# EAGLE design 503-WS2811-Multi_RV100 (EAGLE 9.6.2)
AUTHORS: Design: Dominik - Idee: Hardi & Michael; DATUM: 2021-08-15; VERSION: Ver.: 0.6

## Sheet 1 of 2
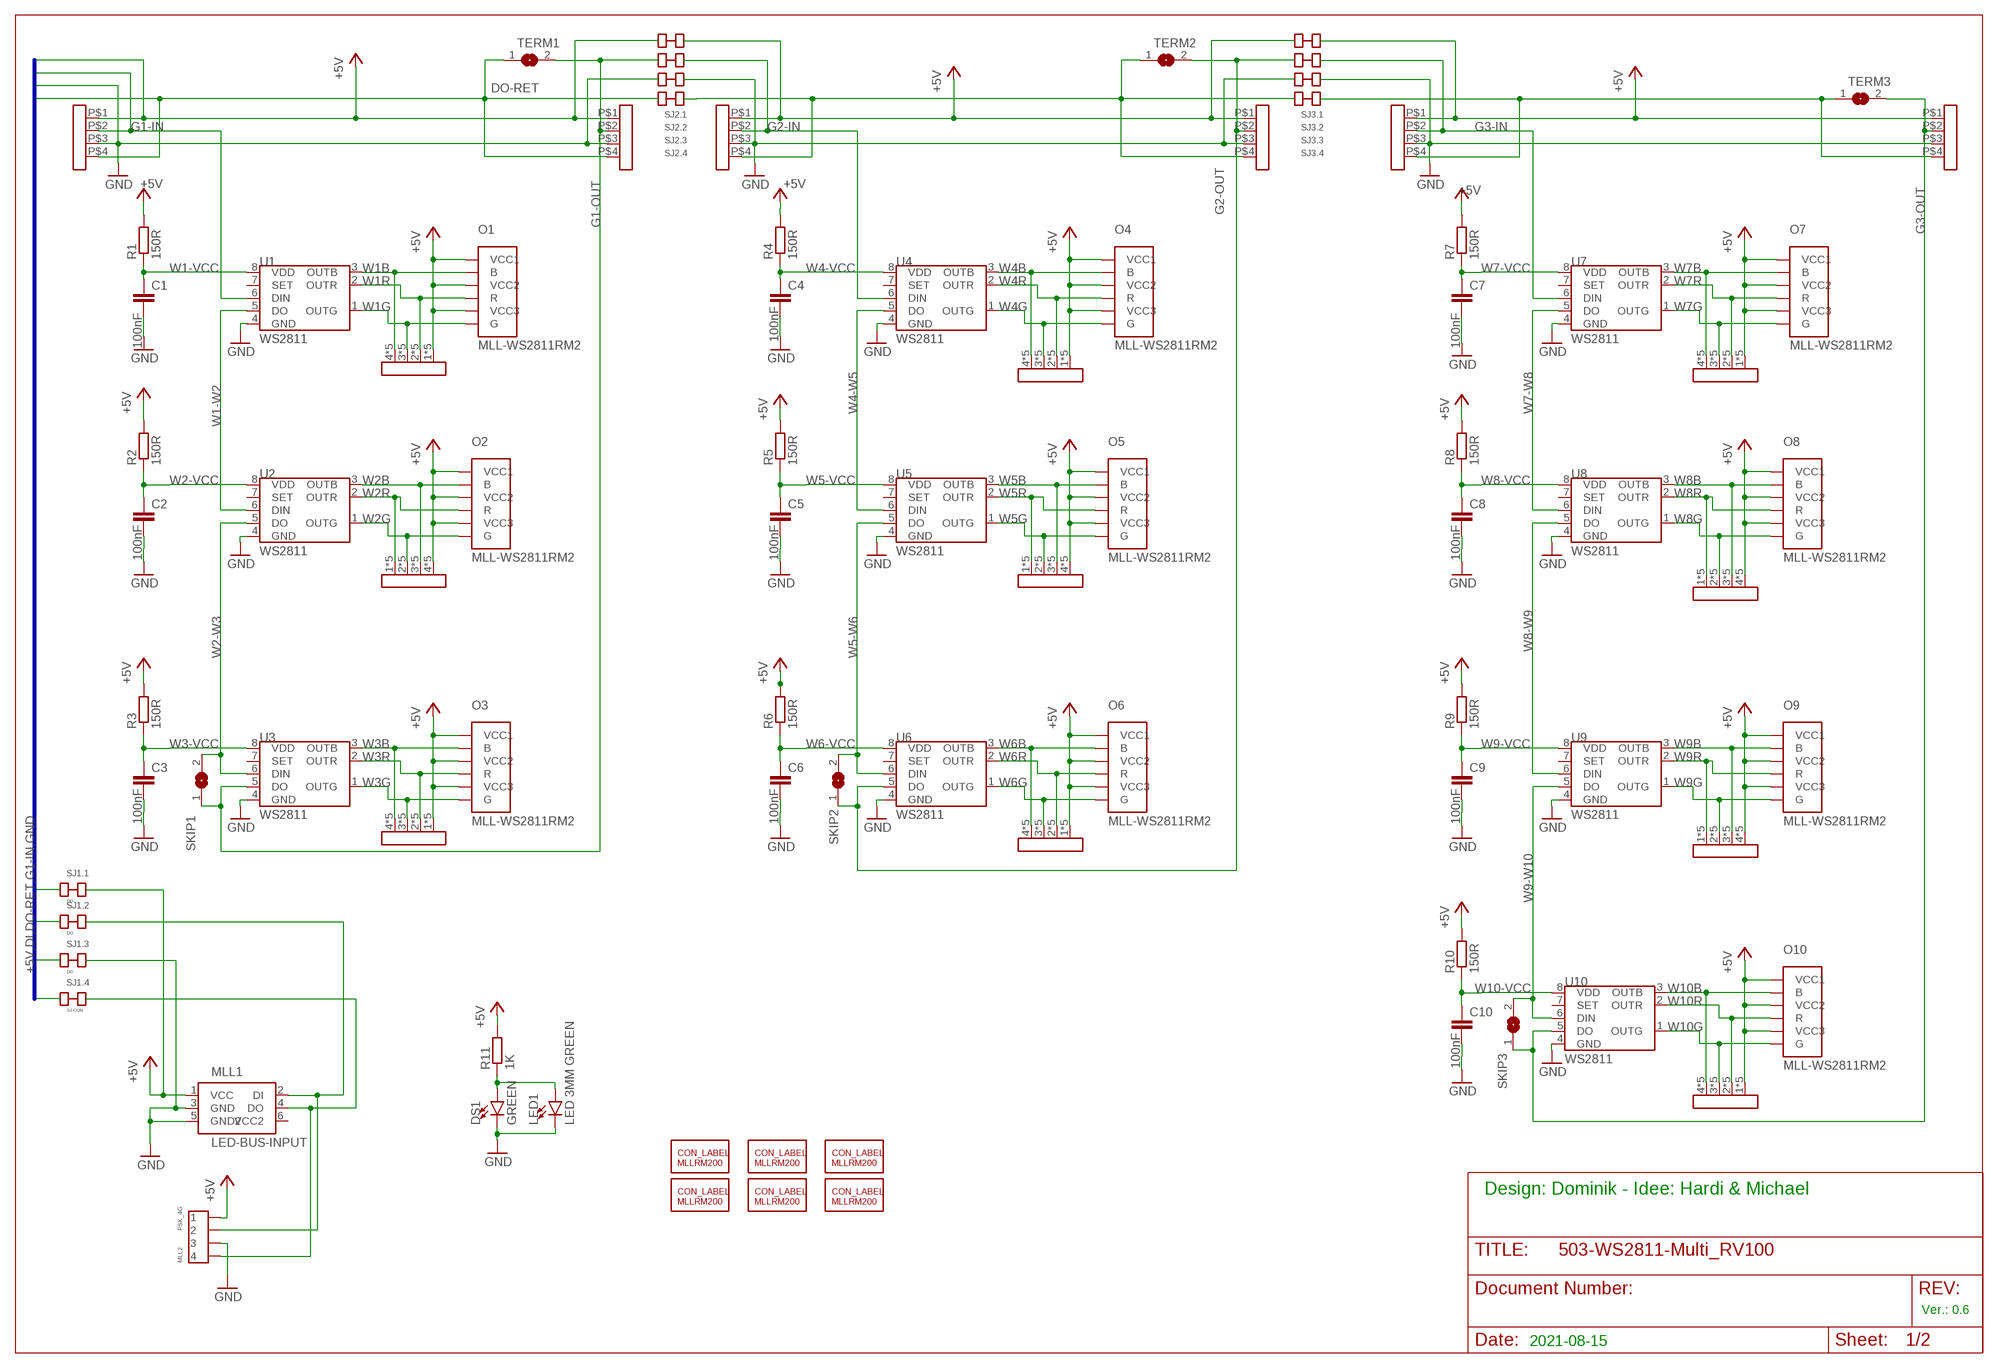
[diagram p0: schematic, sheet 1]

### Parts
C1  100nF  C-EUC1206  [C1206]
C2  100nF  C-EUC1206  [C1206]
C3  100nF  C-EUC1206  [C1206]
C4  100nF  C-EUC1206  [C1206]
C5  100nF  C-EUC1206  [C1206]
C6  100nF  C-EUC1206  [C1206]
C7  100nF  C-EUC1206  [C1206]
C8  100nF  C-EUC1206  [C1206]
C9  100nF  C-EUC1206  [C1206]
C10  100nF  C-EUC1206  [C1206]
DS1  GREEN  LED-GREEN1206  [LED-1206]
IN  4XRM254  [4XRM254]
LED1  LED 3MM GREEN  LED3MM  [LED_3MM]
M1_IN  4XRM254  [4XRM254]
M1_OUT  4XRM254  [4XRM254]
M2_IN  4XRM254  [4XRM254]
M2_OUT  4XRM254  [4XRM254]
MLL1  LED-BUS-INPUT  [IDC6]
MLL2  PSK_4G  [PSSG4]
O1  MLL-WS2811RM2  [MLL-WS2811-RM2]
O2  MLL-WS2811RM2  [MLL-WS2811-RM2]
O3  MLL-WS2811RM2  [MLL-WS2811-RM2]
O4  MLL-WS2811RM2  [MLL-WS2811-RM2]
O5  MLL-WS2811RM2  [MLL-WS2811-RM2]
O6  MLL-WS2811RM2  [MLL-WS2811-RM2]
O7  MLL-WS2811RM2  [MLL-WS2811-RM2]
O8  MLL-WS2811RM2  [MLL-WS2811-RM2]
O9  MLL-WS2811RM2  [MLL-WS2811-RM2]
O10  MLL-WS2811RM2  [MLL-WS2811-RM2]
OUT  4XRM254  [4XRM254]
R1  150R  R-EU_R1206  [R1206]
R2  150R  R-EU_R1206  [R1206]
R3  150R  R-EU_R1206  [R1206]
R4  150R  R-EU_R1206  [R1206]
R5  150R  R-EU_R1206  [R1206]
R6  150R  R-EU_R1206  [R1206]
R7  150R  R-EU_R1206  [R1206]
R8  150R  R-EU_R1206  [R1206]
R9  150R  R-EU_R1206  [R1206]
R10  150R  R-EU_R1206  [R1206]
R11  1K  R-EU_R1206  [R1206]
SJ1.1  DO  SJ-CON  [SJ-CON]
SJ1.2  DO  SJ-CON  [SJ-CON]
SJ1.3  DO  SJ-CON  [SJ-CON]
SJ1.4  SJ-CON  [SJ-CON]
SJ2.1  SJ-CON  [SJ-CON]
SJ2.2  SJ-CON  [SJ-CON]
SJ2.3  SJ-CON  [SJ-CON]
SJ2.4  SJ-CON  [SJ-CON]
SJ3.1  SJ-CON  [SJ-CON]
SJ3.2  SJ-CON  [SJ-CON]
SJ3.3  SJ-CON  [SJ-CON]
SJ3.4  SJ-CON  [SJ-CON]
SKIP1  SJ  [SJ]
SKIP2  SJ  [SJ]
SKIP3  SJ  [SJ]
TERM1  SJ  [SJ]
TERM2  SJ  [SJ]
TERM3  SJ  [SJ]
U1  WS2811  WS2811-ICSOP8  [SOP8]
U2  WS2811  WS2811-ICSOP8  [SOP8]
U3  WS2811  WS2811-ICSOP8  [SOP8]
U4  WS2811  WS2811-ICSOP8  [SOP8]
U5  WS2811  WS2811-ICSOP8  [SOP8]
U6  WS2811  WS2811-ICSOP8  [SOP8]
U7  WS2811  WS2811-ICSOP8  [SOP8]
U8  WS2811  WS2811-ICSOP8  [SOP8]
U9  WS2811  WS2811-ICSOP8  [SOP8]
U10  WS2811  WS2811-ICSOP8  [SOP8]
U$1  CON-LABEL_MLLRM200_2RGB_M  [CON-LABEL_MLLRM200_RGB_M]
U$2  CON-LABEL_MLLRM200_3  [CON-LABEL_MLLRM200_3]
U$3  CON-LABEL_MLLRM200_2RGB_M  [CON-LABEL_MLLRM200_RGB_M]
U$4  CON-LABEL_MLLRM200_2RGB_M  [CON-LABEL_MLLRM200_RGB_M]
U$5  CON-LABEL_MLLRM200_2RGB  [CON-LABEL_MLLRM200_RGB]
U$6  CON-LABEL_MLLRM200_3  [CON-LABEL_MLLRM200_3]
U$7  4XRM200LONG-NOH_DOUBLE  [4XRM200LONG_NOH_DOUBLE]
U$8  4XRM200LONG-NOH_DOUBLE  [4XRM200LONG_NOH_DOUBLE]
U$9  4XRM200LONG-NOH_DOUBLE  [4XRM200LONG_NOH_DOUBLE]
U$14  4XRM200LONG-NOH_DOUBLE  [4XRM200LONG_NOH_DOUBLE]
U$15  4XRM200LONG-NOH_DOUBLE  [4XRM200LONG_NOH_DOUBLE]
U$16  4XRM200LONG-NOH_DOUBLE  [4XRM200LONG_NOH_DOUBLE]
U$17  4XRM200LONG-NOH_DOUBLE  [4XRM200LONG_NOH_DOUBLE]
U$18  4XRM200LONG-NOH_DOUBLE  [4XRM200LONG_NOH_DOUBLE]
U$19  4XRM200LONG-NOH_DOUBLE  [4XRM200LONG_NOH_DOUBLE]
U$20  4XRM200LONG-NOH_DOUBLE  [4XRM200LONG_NOH_DOUBLE]

### Nets
+5V: IN.P$1 M1_IN.P$1 M1_OUT.P$1 M2_IN.P$1 M2_OUT.P$1 MLL1.1(VCC) MLL2.P$1 O1.VCC1 O1.VCC2 O1.VCC3 O2.VCC1 O2.VCC2 O2.VCC3 O3.VCC1 O3.VCC2 O3.VCC3 O4.VCC1 O4.VCC2 O4.VCC3 O5.VCC1 O5.VCC2 O5.VCC3 O6.VCC1 O6.VCC2 O6.VCC3 O7.VCC1 O7.VCC2 O7.VCC3 O8.VCC1 O8.VCC2 O8.VCC3 O9.VCC1 O9.VCC2 O9.VCC3 O10.VCC1 O10.VCC2 O10.VCC3 OUT.P$1 R1.2 R2.2 R3.2 R4.2 R5.2 R6.2 R7.2 R8.2 R9.2 R10.2 R11.2 SJ1.1.P$1 SJ1.1.P$2 SJ2.1.P$1 SJ2.1.P$2 SJ3.1.P$1 SJ3.1.P$2 U$7.1 U$7.1B U$7.11 U$7.12 U$7.13 U$8.4 U$8.4B U$8.41 U$8.42 U$8.43 U$9.1 U$9.1B U$9.11 U$9.12 U$9.13 U$14.1 U$14.1B U$14.11 U$14.12 U$14.13 U$15.4 U$15.4B U$15.41 U$15.42 U$15.43 U$16.1 U$16.1B U$16.11 U$16.12 U$16.13 U$17.1 U$17.1B U$17.11 U$17.12 U$17.13 U$18.4 U$18.4B U$18.41 U$18.42 U$18.43 U$19.4 U$19.4B U$19.41 U$19.42 U$19.43 U$20.1 U$20.1B U$20.11 U$20.12 U$20.13
DI: MLL1.2(DI) MLL2.P$2 SJ1.2.P$2
DO: MLL1.4(DO) MLL2.P$4 SJ1.4.P$2
DO-RET: M1_IN.P$4 M1_OUT.P$4 SJ1.4.P$1 SJ2.4.P$1 TERM1.1
G1-IN: M1_IN.P$2 SJ1.2.P$1 U1.6(DIN)
G1-OUT: M1_OUT.P$2 SJ2.2.P$1 SKIP1.1 TERM1.2 U3.5(DO)
G2-IN: M2_IN.P$2 SJ2.2.P$2 U4.6(DIN)
G2-OUT: M2_OUT.P$2 SJ3.2.P$1 SKIP2.1 TERM2.2 U6.5(DO)
G2-RET: M2_IN.P$4 M2_OUT.P$4 SJ2.4.P$2 SJ3.4.P$1 TERM2.1
G3-IN: IN.P$2 SJ3.2.P$2 U7.6(DIN)
G3-OUT: OUT.P$2 SKIP3.1 TERM3.2 U10.5(DO)
G3-RET: IN.P$4 OUT.P$4 SJ3.4.P$2 TERM3.1
GND: C1.2 C2.2 C3.2 C4.2 C5.2 C6.2 C7.2 C8.2 C9.2 C10.2 DS1.C IN.P$3 LED1.K(C) M1_IN.P$3 M1_OUT.P$3 M2_IN.P$3 M2_OUT.P$3 MLL1.3(GND) MLL1.5(GND2) MLL2.P$3 OUT.P$3 SJ1.3.P$1 SJ1.3.P$2 SJ2.3.P$1 SJ2.3.P$2 SJ3.3.P$1 SJ3.3.P$2 U1.4(GND) U2.4(GND) U3.4(GND) U4.4(GND) U5.4(GND) U6.4(GND) U7.4(GND) U8.4(GND) U9.4(GND) U10.4(GND)
LED1: DS1.A LED1.A R11.1
W1-VCC: C1.1 R1.1 U1.8(VDD)
W1-W2: U1.5(DO) U2.6(DIN)
W1B: O1.B U1.3(OUTB) U$9.4 U$9.4B U$9.41 U$9.42 U$9.43
W1G: O1.G U1.1(OUTG) U$9.3 U$9.3B U$9.31 U$9.32 U$9.33
W1R: O1.R U1.2(OUTR) U$9.2 U$9.2B U$9.21 U$9.22 U$9.23
W2-VCC: C2.1 R2.1 U2.8(VDD)
W2-W3: SKIP1.2 U2.5(DO) U3.6(DIN)
W2B: O2.B U2.3(OUTB) U$8.3 U$8.3B U$8.31 U$8.32 U$8.33
W2G: O2.G U2.1(OUTG) U$8.2 U$8.2B U$8.21 U$8.22 U$8.23
W2R: O2.R U2.2(OUTR) U$8.1 U$8.1B U$8.11 U$8.12 U$8.13
W3-VCC: C3.1 R3.1 U3.8(VDD)
W3B: O3.B U3.3(OUTB) U$7.4 U$7.4B U$7.41 U$7.42 U$7.43
W3G: O3.G U3.1(OUTG) U$7.3 U$7.3B U$7.31 U$7.32 U$7.33
W3R: O3.R U3.2(OUTR) U$7.2 U$7.2B U$7.21 U$7.22 U$7.23
W4-VCC: C4.1 R4.1 U4.8(VDD)
W4-W5: U4.5(DO) U5.6(DIN)
W4B: O4.B U4.3(OUTB) U$14.4 U$14.4B U$14.41 U$14.42 U$14.43
W4G: O4.G U4.1(OUTG) U$14.3 U$14.3B U$14.31 U$14.32 U$14.33
W4R: O4.R U4.2(OUTR) U$14.2 U$14.2B U$14.21 U$14.22 U$14.23
W5-VCC: C5.1 R5.1 U5.8(VDD)
W5-W6: SKIP2.2 U5.5(DO) U6.6(DIN)
W5B: O5.B U5.3(OUTB) U$15.3 U$15.3B U$15.31 U$15.32 U$15.33
W5G: O5.G U5.1(OUTG) U$15.2 U$15.2B U$15.21 U$15.22 U$15.23
W5R: O5.R U5.2(OUTR) U$15.1 U$15.1B U$15.11 U$15.12 U$15.13
W6-VCC: C6.1 R6.1 U6.8(VDD)
W6B: O6.B U6.3(OUTB) U$16.4 U$16.4B U$16.41 U$16.42 U$16.43
W6G: O6.G U6.1(OUTG) U$16.3 U$16.3B U$16.31 U$16.32 U$16.33
W6R: O6.R U6.2(OUTR) U$16.2 U$16.2B U$16.21 U$16.22 U$16.23
W7-VCC: C7.1 R7.1 U7.8(VDD)
W7-W8: U7.5(DO) U8.6(DIN)
W7B: O7.B U7.3(OUTB) U$17.4 U$17.4B U$17.41 U$17.42 U$17.43
W7G: O7.G U7.1(OUTG) U$17.3 U$17.3B U$17.31 U$17.32 U$17.33
W7R: O7.R U7.2(OUTR) U$17.2 U$17.2B U$17.21 U$17.22 U$17.23
W8-VCC: C8.1 R8.1 U8.8(VDD)
W8-W9: U8.5(DO) U9.6(DIN)
W8B: O8.B U8.3(OUTB) U$18.3 U$18.3B U$18.31 U$18.32 U$18.33
W8G: O8.G U8.1(OUTG) U$18.2 U$18.2B U$18.21 U$18.22 U$18.23
W8R: O8.R U8.2(OUTR) U$18.1 U$18.1B U$18.11 U$18.12 U$18.13
W9-VCC: C9.1 R9.1 U9.8(VDD)
W9-W10: SKIP3.2 U9.5(DO) U10.6(DIN)
W9B: O9.B U9.3(OUTB) U$19.3 U$19.3B U$19.31 U$19.32 U$19.33
W9G: O9.G U9.1(OUTG) U$19.2 U$19.2B U$19.21 U$19.22 U$19.23
W9R: O9.R U9.2(OUTR) U$19.1 U$19.1B U$19.11 U$19.12 U$19.13
W10-VCC: C10.1 R10.1 U10.8(VDD)
W10B: O10.B U10.3(OUTB) U$20.4 U$20.4B U$20.41 U$20.42 U$20.43
W10G: O10.G U10.1(OUTG) U$20.3 U$20.3B U$20.31 U$20.32 U$20.33
W10R: O10.R U10.2(OUTR) U$20.2 U$20.2B U$20.21 U$20.22 U$20.23
Unconnected: U1.7(SET) U2.7(SET) U3.7(SET) U4.7(SET) U5.7(SET) U6.7(SET) U7.7(SET) U8.7(SET) U9.7(SET) U10.7(SET)

### Buses
+5V,DI,DO-RET,G1-IN,GND

## Sheet 2 of 2
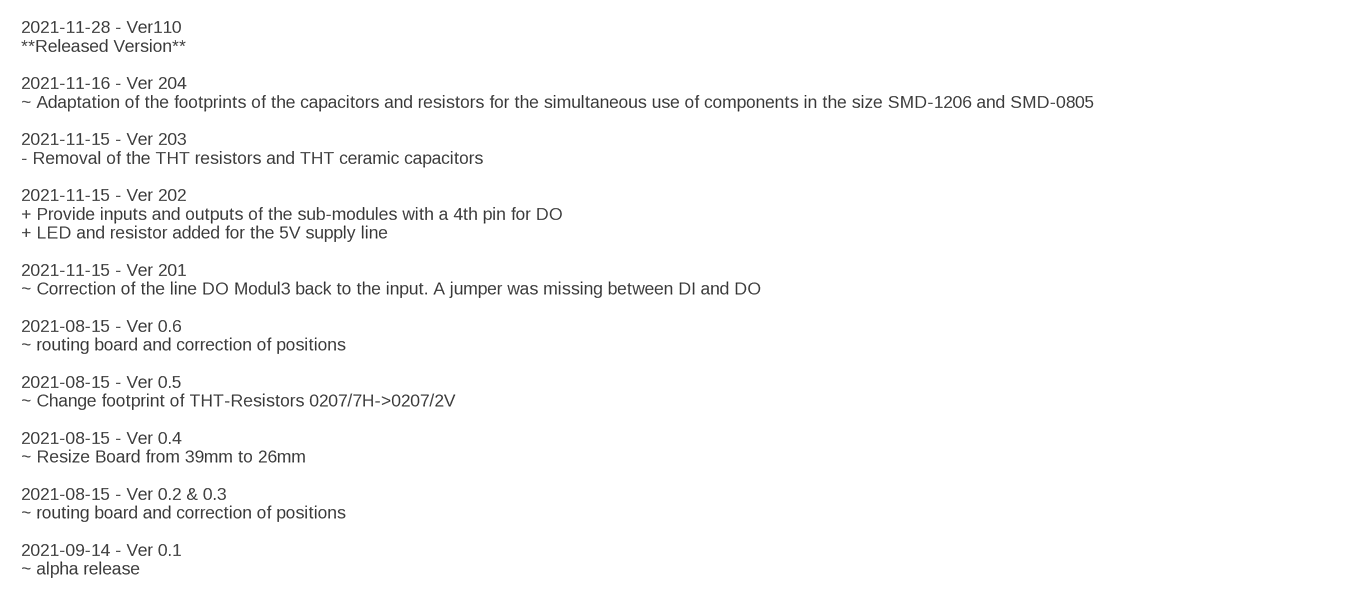
[diagram p1: schematic, sheet 2]

### Notes on the sheet
- 2021-11-28 - Ver110
  **Released Version**
  
  2021-11-16 - Ver 204
  ~ Adaptation of the footprints of the capacitors and resistors for the simultaneous use of components in the size SMD-1206 and SMD-0805 
  
  2021-11-15 - Ver 203
  - Removal of the THT resistors and THT ceramic capacitors 
  
  2021-11-15 - Ver 202
  + Provide inputs and outputs of the sub-modules with a 4th pin for DO
  + LED and resistor added for the 5V supply line
  
  2021-11-15 - Ver 201
  ~ Correction of the line DO Modul3 back to the input. A jumper was missing between DI and DO
  
  2021-08-15 - Ver 0.6
  ~ routing board and correction of positions
  
  2021-08-15 - Ver 0.5
  ~ Change footprint of THT-Resistors 0207/7H->0207/2V
  
  2021-08-15 - Ver 0.4
  ~ Resize Board from 39mm to 26mm
  
  2021-08-15 - Ver 0.2 & 0.3
  ~ routing board and correction of positions
  
  2021-09-14 - Ver 0.1
  ~ alpha release

## Power pins joined to a net without a drawn wire
VCC2: MLL1.6(VCC2)

## Library data of the parts
C1-C10 = rcl:C-EU: CAPACITOR, European symbol; SPICEPREFIX: C
DS1 = SparkFun-LED:LED-GREEN: Green SMD LED Used in manufacturing of various products at SparkFun Packages: 0603 - SMD 0603 package [Product Link] <http://www.futureelectronics.com/en/technologies/semiconductors/optoelectronics/leds/Pages/9894312-LTST-C190GKT.aspx?CrossPart=HSMG-C190&IM=0> LilyPad 1206 - SMD1206 LilyPad package [Product Link] <http://www.futureelectronics.com/en/Technologies/Product.aspx?ProductID=IN150NGHARVATEKCORPORATION2049943&IM=0> 1206 - SMD1206 package [Product Link] <http://www.futureelectronics.com/en/technologies/semiconductors/optoelectronics/leds/Pages/8315665-LTST-C150KGKT.aspx?IM=0> 1206 Bottom Mount -SMD 1206 Bottom Mount [Product Link] <http://www.digikey.com/product-detail/en/lite-on-inc/LTST-C230KGKT/160-1456-1-ND/386854> SparkFun Products: Pro Mini 328 -5V <https://www.sparkfun.com/products/821> RedBoard <https://www.sparkfun.com/products/12757> MP3 Trigger <https://www.sparkfun.com/products/13720> Makey Makey <https://www.sparkfun.com/products/11076>; PROD_ID: DIO-00862
IN M1_IN M1_OUT M2_IN M2_OUT OUT = MLL-Dominik-Hardi:4XRM254
LED1 = SparkFun-LED:LED: LED (Generic) Standard schematic elements and footprints for 5mm, 3mm, 1206, and 0603 sized LEDs. Generic LEDs with no color specified.; PROD_ID: DIO-08794
MLL1 = MLL-Dominik-Hardi:LED-BUS-INPUT
MLL2 = MLL-Dominik-Hardi:PSK_4
O1-O10 = MLL-Dominik-Hardi:MLL-WS2811RM2
R1-R11 = rcl:R-EU_: RESISTOR, European symbol; SPICEPREFIX: R
SJ1.1-SJ1.4 SJ2.1-SJ2.4 SJ3.1-SJ3.4 = MLL-Dominik-Hardi:SJ-CON
SKIP1-SKIP3 TERM1-TERM3 = jumper:SJ: SMD solder JUMPER
U1-U10 = MLL-Dominik-Hardi:WS2811-IC: Die Pin Nummern für R und G sind getauscht damit sie gleich angesteuert werden wie die WS2812. Der Daten Strom der WS2811 ist RGB, Beim WS2812 ist es aber GRB.
U$1 U$3-U$5 = MLL-Dominik-Hardi:CON-LABEL_MLLRM200_2
U$2 U$6 = MLL-Dominik-Hardi:CON-LABEL_MLLRM200_3
U$7-U$9 U$14-U$20 = MLL-Dominik-Hardi:4XRM200LONG-NOH_DOUBLE

## Board
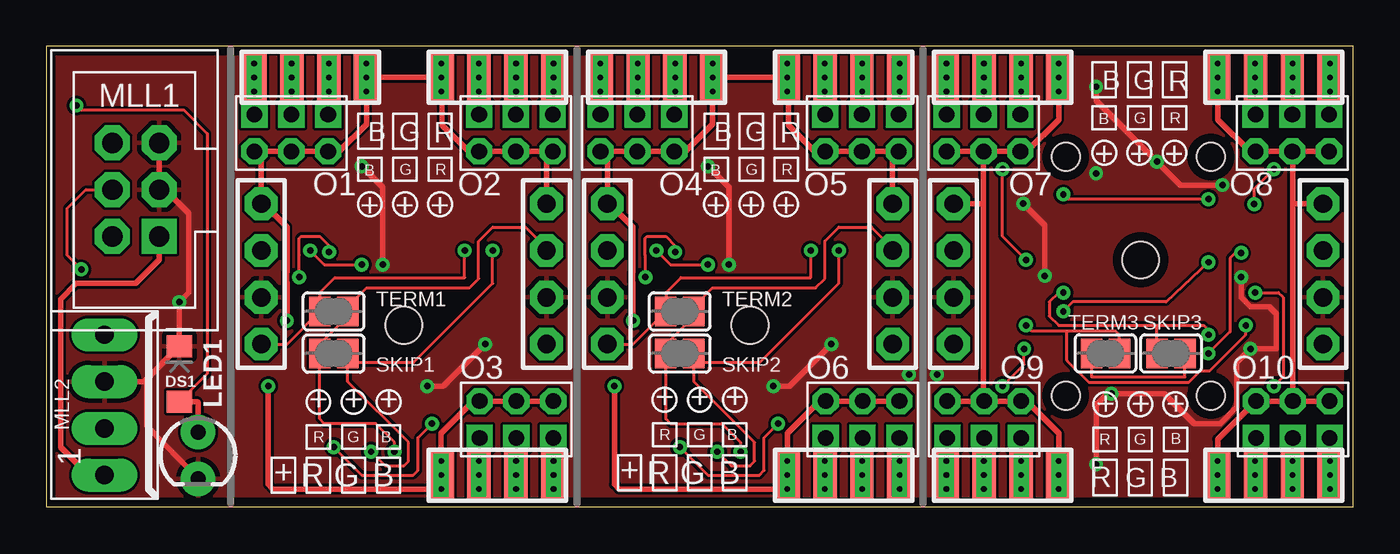
[diagram p2: board, top side]
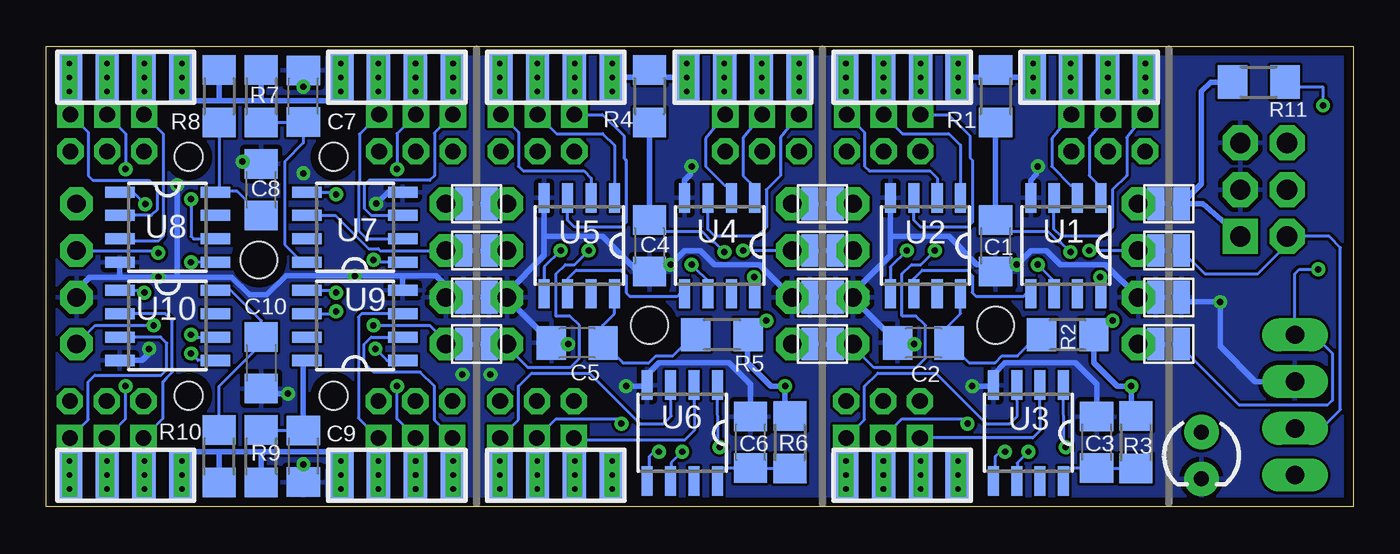
[diagram p3: board, bottom side, seen from below]

Size 71 x 25 mm. Coordinates in mm from the lower left corner, seen from the top.
Outline: 0,0 71,0 71,25 0,25 0,0
Copper layers (1*16): Top 0.035mm / dielectric 1.5mm / Bottom 0.035mm
Design rules "default *": minimum track width 6mil, minimum drill 0.35mm, track to track 6mil, track to pad 6mil, pad to pad 6mil, via to via 6mil, smd to smd 6mil, copper to edge 20mil, drill to drill 6mil, minimum pad ring 10mil, minimum via ring 8mil, stop-mask expansion 4mil, vias tented up to drill 16mil, thermal gap 10mil
Holes 1.98 mm at 59.44,13.39
Holes 1.52 mm at 55.37,18.98 63.25,18.98 55.37,6.02 63.25,6.02
Holes 2.01 mm at 38.23,9.83 19.43,9.83

### Footprints (pad centres in the part's own frame; a part is rotated, then mirrored left to right if it is on the bottom)
C1206 = smd 1.6 x 1.8: 1 -1.4,0; 2 1.4,0
LED-1206 = smd 1.2 x 1.4: A -1.5,0; C 1.5,0
4XRM254 = drill 1 pad 1.778 octagon: P$1 0,3.81; P$2 0,1.27; P$3 0,-1.27; P$4 0,-3.81
LED_3MM = drill 0.813 pad 1.88: A -1.27,0; K 1.27,0
IDC6 = drill 1.1 pad 1.9 square: 1 -2.54,-1.27 | drill 1.1 pad 1.9 octagon: 2 -2.54,1.27; 3 0,-1.27; 4 0,1.27; 5 2.54,-1.27; 6 2.54,1.27
PSSG4 = drill 1 pad 1.778 long: P$1 3.81,0; P$2 1.27,0; P$3 -1.27,0; P$4 -3.81,0
MLL-WS2811-RM2 = drill 0.85 pad 1.422 square: B 2.015,-1.032; G 0.015,-1.032; R -1.984,-1.032 | drill 0.85 pad 1.422 octagon: VCC1 2.015,0.968; VCC2 -1.984,0.968; VCC3 0.015,0.968
R1206 = smd 1.6 x 1.803: 1 -1.422,0; 2 1.422,0
SJ-CON = smd 0.914 x 1.778: P$1 -0.699,0; P$2 0.699,0
SJ = smd 1.168 x 1.6: 1 -0.762,0; 2 0.762,0
SOP8 = smd 0.6 x 1.6: 1 -1.905,-2.6; 2 -0.635,-2.6; 3 0.635,-2.6; 4 1.905,-2.6; 5 1.905,2.6; 6 0.635,2.6; 7 -0.635,2.6; 8 -1.905,2.6
4XRM200LONG_NOH_DOUBLE = smd 2.54 x 1.27: 1 0,3; 2 0,1; 3 0,-1; 4 0,-3 | smd 2.54 x 1.27 bottom: 1B 0,3; 2B 0,1; 3B 0,-1; 4B 0,-3 | drill 0.305 square: 11 -0.762,3.048; 12 0,3.048; 13 0.762,3.048; 21 -0.762,1.016; 22 0,1.016; 23 0.762,1.016; 31 -0.762,-1.016; 32 0,-1.016; 33 0.762,-1.016; 41 -0.762,-3.048; 42 0,-3.048; 43 0.762,-3.048

### Placement (x,y rotation side)
C1  19.43,14.15 270 bottom
C2  23.36,8.88 180 bottom
C3  13.94,3.48 90 bottom
C4  38.23,14.15 270 bottom
C5  42.15,8.88 180 bottom
C6  32.74,3.48 90 bottom
C7  57.02,22.28 90 bottom
C8  59.31,17.2 90 bottom
C9  57.02,2.72 270 bottom
C10  59.31,7.8 270 bottom
DS1  7.24,7.19 90 top
IN  49.28,12.63 0 top
LED1  8.26,2.77 270 top
M1_IN  11.68,12.63 0 top
M1_OUT  27.18,12.63 0 top
M2_IN  30.48,12.63 0 top
M2_OUT  45.97,12.63 0 top
MLL1  4.88,17.2 90 top
MLL2  3.17,5.52 270 top
O1  13.34,20.25 180 top
O2  25.53,20.25 180 top
O3  25.53,4.75 0 top
O4  32.13,20.25 180 top
O5  44.32,20.25 180 top
O6  44.32,4.75 0 top
O7  50.93,20.25 180 top
O8  67.69,20.25 180 top
O9  50.93,4.75 0 top
O10  67.69,4.75 0 top
OUT  69.34,12.63 0 top
R1  19.43,22.28 90 bottom
R2  15.52,9.33 0 bottom
R3  11.81,3.48 90 bottom
R4  38.23,22.28 90 bottom
R5  34.29,9.33 0 bottom
R6  30.61,3.48 90 bottom
R7  59.31,22.28 90 bottom
R8  61.6,22.28 90 bottom
R9  59.31,2.72 270 bottom
R10  61.6,2.72 270 bottom
R11  5.14,23.04 180 bottom
SJ1.1  10.03,16.44 0 bottom
SJ1.2  10.03,13.9 0 bottom
SJ1.3  10.03,11.36 0 bottom
SJ1.4  10.03,8.82 0 bottom
SJ2.1  28.83,16.44 180 bottom
SJ2.2  28.83,13.9 180 bottom
SJ2.3  28.83,11.36 180 bottom
SJ2.4  28.83,8.82 180 bottom
SJ3.1  47.62,16.44 180 bottom
SJ3.2  47.62,13.9 180 bottom
SJ3.3  47.62,11.36 180 bottom
SJ3.4  47.62,8.82 180 bottom
SKIP1  15.62,8.31 0 top
SKIP2  34.42,8.31 0 top
SKIP3  61.09,8.31 180 top
TERM1  15.62,10.6 0 top
TERM2  34.42,10.6 0 top
TERM3  57.53,8.31 180 top
U1  15.62,14.15 180 bottom
U2  23.24,14.15 180 bottom
U3  17.65,3.99 180 bottom
U4  34.42,14.15 180 bottom
U5  42.04,14.15 180 bottom
U6  36.45,3.99 180 bottom
U7  54.23,15.17 90 bottom
U8  64.39,15.17 270 bottom
U9  54.23,9.83 90 bottom
U10  64.39,9.83 270 bottom
U$1  39.24,18.47 180 top
U$2  15.75,3.61 0 top
U$3  20.45,18.47 180 top
U$4  60.33,21.26 180 top
U$5  58.47,3.48 0 top
U$6  34.54,3.74 0 top
U$7  24.51,1.71 90 top
U$8  24.51,23.3 270 top
U$9  14.35,23.3 270 top
U$14  33.15,23.3 270 top
U$15  43.31,23.3 270 top
U$16  43.31,1.71 90 top
U$17  51.94,23.3 270 top
U$18  66.67,23.3 270 top
U$19  51.94,1.71 270 bottom
U$20  66.67,1.71 90 top

### Tracks (layer width: path | path; a pad name or v marks a point on that pad's centre or on a via)
+5V  (via drill 0.35)
  Top 0.305: U$9.12 17.4,20.76 15.92,19.28 O1.VCC2 O1.VCC3 O1.VCC1 11.68,18.92 M1_IN.P$1 11.81,16.44 13.08,15.17 13.08,12.75 13.07,12.74 13.07,12.17 13.08,12.16 v13.08,10.09 | U$9.1B U$8.4B 21.51,20.71 22.99,19.23 23.46,19.23 O2.VCC1 O2.VCC3 O2.VCC2 27.18,18.95 M1_OUT.P$1 | O3.VCC1 O3.VCC3 O3.VCC2 23.19,5.72 21.46,3.99 U$7.13 | U$7.1B 20.75,0.94 12.32,0.94 12.07,1.2 v12.07,6.53 | O9.VCC2 O9.VCC3 | O9.VCC3 O9.VCC1 53.26,5.72 54.99,3.99 U$19.41 | O10.VCC1 O10.VCC3 | O10.VCC3 O10.VCC2 65.69,5.72 63.63,3.66 U$20.13 | O10.VCC3 67.71,16.44 | 67.71,16.44 67.71,19.25 O8.VCC3 | O8.VCC3 O8.VCC2 | O8.VCC3 O8.VCC1 65.36,19.28 63.63,21.01 63.63,23.25 U$18.4 | 50.91,19.23 O7.VCC3 O7.VCC2 53.26,19.28 54.99,21.01 U$17.13 | 50.91,19.23 50.91,16.44 | 50.91,16.44 50.91,5.75 O9.VCC3 | 50.91,16.44 IN.P$1 | OUT.P$1 67.71,16.44 | O7.VCC1 50.86,19.28 50.91,19.23 | U$14.12 36.2,20.76 34.72,19.28 O4.VCC2 O4.VCC3 O4.VCC1 30.48,18.92 M2_IN.P$1 30.61,16.44 31.88,15.17 31.88,12.75 31.86,12.74 31.86,12.17 31.88,12.16 v31.88,10.09 | U$14.1B U$15.4B 40.31,20.71 41.78,19.23 42.26,19.23 O5.VCC1 O5.VCC3 O5.VCC2 45.97,18.95 M2_OUT.P$1 | O6.VCC1 O6.VCC3 O6.VCC2 41.99,5.72 40.26,3.99 U$16.13 | U$16.1B 39.55,0.94 31.11,0.94 30.86,1.2 v30.86,6.53 | MLL2.P$1 2.31,1.71 0.79,3.23 0.79,11.26 1.65,12.12 4.88,12.12 6.15,13.39 MLL1.1
  Bottom 0.152: R2.2 13.08,9.97 v13.08,10.09 | R5.2 31.88,9.97 v31.88,10.09
  Bottom 0.305: U$8.4B 19.84,23.3 R1.2 19.02,23.3 U$9.12 | R3.2 12.07,5.16 v12.07,6.53 12.83,6.53 14.1,7.8 R2.2 | U$19.4 55.5,2.26 55.5,2.98 59.16,2.98 | U$20.13 63.37,2.98 61.6,2.98 | 59.16,2.98 61.6,2.98 | 59.16,2.98 59.31,2.82 R9.2 | 61.6,2.98 R10.2 | U$17.1B 54.99,23.25 U$17.13 54.99,22.03 59.31,22.03 | U$18.43 63.12,22.03 61.6,22.03 | 59.31,22.03 61.6,22.03 | 61.6,22.03 R8.2 | 59.31,22.03 R7.2 | U$15.4B 38.63,23.3 R4.2 37.82,23.3 U$14.12 | R6.2 30.86,5.16 v30.86,6.53 31.62,6.53 32.89,7.8 R5.2 | SJ1.1.P$2 8.26,17.52 8.26,22.53 7.75,23.04 R11.2 | MLL1.1 8.18,16.44 M1_IN.P$1 | M2_OUT.P$1 SJ3.1.P$1 SJ3.1.P$2 IN.P$1 | M1_IN.P$1 SJ1.1.P$1 SJ1.1.P$2 | SJ1.1.P$2 M1_IN.P$1 | M2_IN.P$1 SJ2.1.P$2 SJ2.1.P$1 M1_OUT.P$1
DI
  Bottom 0.152: MLL2.P$2 1.73,4.25 0.71,5.26 0.71,14.05 1.32,14.66 MLL1.2 3.61,14.23 5.21,12.63 8.06,12.63 SJ1.2.P$2
DO  (via drill 0.35)
  Top 0.152: v1.92,12.87 1.14,13.64 1.14,16.18 2.16,17.2 MLL1.4
  Bottom 0.152: v1.92,12.87 2.93,12.87 3.17,12.63 MLL2.P$4 2.16,9.33 1.14,8.31 1.14,5.77 1.4,5.52 6.22,5.52 8.83,8.12 9.33,8.63 SJ1.4.P$2
DO-RET  (via drill 0.35)
  Top 0.152: v22.73,13.9 22.73,12.43 15.67,12.43 14.86,11.61 TERM1.1 13.08,8.82 M1_IN.P$4
  Bottom 0.152: v22.73,13.9 23.49,13.14 24,13.14 24.51,12.63 24.51,10.34 23.75,10.34 23.24,9.83 23.24,8.06 23.75,7.55 26.04,7.55 27.18,8.69 M1_OUT.P$4 SJ2.4.P$1 | SJ1.4.P$1 M1_IN.P$4
G1-IN  (via drill 0.35)
  Top 0.152: v14.35,13.9 15.11,13.14 v17.14,13.14
  Bottom 0.152: v14.35,13.9 M1_IN.P$2 SJ1.2.P$1 | v17.14,13.14 16.13,12.12 16.13,11.68 U1.6
G1-OUT  (via drill 0.35)
  Top 0.152: M1_OUT.P$2 27.18,14.03 26.04,15.17 24.26,15.17 23.49,14.41 23.49,12.37 22.99,11.87 17.4,11.87 16.38,10.85 TERM1.2 16.38,10.34 14.86,8.82 SKIP1.1 14.86,4.75 15.11,4.5 17.91,4.5 18.92,3.48 v18.92,2.98
  Bottom 0.152: U3.5 19.43,1.09 19.43,2.72 19.18,2.98 v18.92,2.98
  Bottom 0.305: M1_OUT.P$2 SJ2.2.P$1
G2-IN  (via drill 0.35)
  Top 0.152: v33.15,13.9 33.91,13.14 v35.94,13.14
  Bottom 0.152: v33.15,13.9 M2_IN.P$2 SJ2.2.P$2 | v35.94,13.14 34.93,12.12 34.93,11.68 U4.6
G2-OUT  (via drill 0.35)
  Top 0.152: M2_OUT.P$2 45.97,14.03 44.83,15.17 43.05,15.17 42.29,14.41 42.29,12.37 41.78,11.87 36.2,11.87 35.18,10.85 TERM2.2 35.18,10.34 33.66,8.82 SKIP2.1 33.66,4.75 33.91,4.5 36.7,4.5 37.72,3.48 v37.72,2.98
  Bottom 0.152: U6.5 38.23,1.09 38.23,2.72 37.97,2.98 v37.72,2.98 | SJ3.2.P$1 M2_OUT.P$2
G2-RET  (via drill 0.35)
  Top 0.152: v41.53,13.9 41.53,12.43 34.47,12.43 33.66,11.61 TERM2.1 31.88,8.82 M2_IN.P$4
  Bottom 0.152: v41.53,13.9 42.29,13.14 42.8,13.14 43.31,12.63 43.31,10.34 42.55,10.34 42.04,9.83 42.04,8.06 42.55,7.55 44.83,7.55 45.97,8.69 M2_OUT.P$4 SJ3.4.P$1 | SJ2.4.P$2 M2_IN.P$4
G3-IN
  Bottom 0.152: U7.6 55.3,15.8 53.49,14 52.96,14 52.86,13.9 IN.P$2 SJ3.2.P$2
G3-OUT  (via drill 0.35)
  Top 0.152: TERM3.2 56.77,7.04 61.85,7.04 SKIP3.1 v63.12,8.31 64.29,9.48 64.29,13.47 64.64,13.82 64.88,13.82 v64.9,13.77
  Bottom 0.152: v64.9,13.77 64.9,13.9 OUT.P$2 | U10.5 62.74,7.93 v63.12,8.31
G3-RET  (via drill 0.35)
  Top 0.152: TERM3.1 58.29,9.33 58.09,9.53 55.45,9.53 | v53.21,9.83 53.52,9.53 55.45,9.53 | 55.45,9.53 55.45,7.92 56.64,6.74 62.05,6.74 62.69,7.37 63.2,7.37 65.15,9.33 v65.15,9.83
  Bottom 0.152: v53.21,9.83 50.16,9.83 49.28,8.95 IN.P$4 SJ3.4.P$2 | OUT.P$4 68.33,9.83 v65.15,9.83
GND  (via drill 0.35)
  Top 0.305: v57.02,2.29 57.02,5.52 57.64,6.13 v57.86,6.13 60.73,6.13 62.36,4.5 63.76,4.5 64.67,5.41 64.67,7.83 v65.41,8.56 66.8,8.56 66.8,10.47 66.42,10.85 65.41,10.85 64.9,11.36 v64.9,12.45 | v57.02,22.79 57.02,22.03 v60.33,18.72 61.6,17.45 v63.88,17.45 | v53.06,16.44 54.23,15.28 v54.23,12.53 | v35.94,18.47 37.08,17.33 v37.08,13.14 | v42.64,8.82 40.36,6.53 v39.5,6.53 | v17.14,18.47 18.29,17.33 v18.29,13.14 | v23.85,8.82 21.56,6.53 v20.7,6.53 | LED1.K 5.46,4.37 5.46,6.66 5.33,6.79 | MLL1.5 MLL1.3 6.48,17.2 7.75,15.93 7.75,11.61 v7.24,11.1 DS1.C 5.33,6.79 | 5.33,6.79 MLL2.P$3
  Bottom 0.152: C9.2 v57.02,2.29 | C7.2 v57.02,22.79 | v60.33,18.72 60.2,18.6 C8.2 | 38.33,6.53 U6.4 | 19.53,6.53 U3.4 | 19.94,12.75 C1.2
  Bottom 0.305: 51.69,12.53 49.81,12.53 49.28,11.99 IN.P$3 SJ3.3.P$2 SJ3.3.P$1 M2_OUT.P$3 | 51.69,12.53 v54.23,12.53 57.97,12.53 59.01,11.49 59.94,11.49 60.91,12.45 63.88,12.45 | 63.88,12.45 v64.9,12.45 66.93,12.45 | 66.93,12.45 68.63,12.45 69.34,11.74 OUT.P$3 | U8.4 66.99,12.51 66.93,12.45 | U7.4 52.43,17.07 v53.06,16.44 | U9.4 51.63,12.47 51.69,12.53 | v63.88,17.45 63.88,12.45 | C10.2 59.04,6.13 v57.86,6.13 | U10.4 65.79,7.93 65.41,8.31 v65.41,8.56 | v35.94,18.47 36,18.41 36,18.04 36.32,17.72 U4.4 | M2_OUT.P$3 45.97,11.61 43.94,13.64 43.94,14.66 | 43.94,14.66 U5.4 | C6.2 32.74,6.63 33.91,7.8 37.72,7.8 38.33,7.19 38.33,6.53 v39.5,6.53 | M2_OUT.P$3 45.97,11.3 C5.2 42.71,8.88 v42.64,8.82 | 43.94,14.66 40.77,14.66 38.86,12.75 C4.2 37.84,13.14 v37.08,13.14 36.32,13.9 35.46,13.9 34.7,13.14 32.26,13.14 M2_IN.P$3 SJ2.3.P$2 SJ2.3.P$1 M1_OUT.P$3 | v17.14,18.47 17.21,18.41 17.21,18.04 17.53,17.72 U1.4 | M1_OUT.P$3 27.18,11.61 25.15,13.64 25.15,14.66 | 25.15,14.66 U2.4 | C3.2 13.95,6.63 15.11,7.8 18.92,7.8 19.53,7.19 19.53,6.53 v20.7,6.53 | C1.2 19.05,13.14 v18.29,13.14 17.53,13.9 16.67,13.9 15.9,13.14 13.46,13.14 M1_IN.P$3 SJ1.3.P$1 SJ1.3.P$2 9.33,11.1 v7.24,11.1 DS1.C 5.33,6.79 MLL2.P$3 | M1_OUT.P$3 27.18,11.3 C2.2 23.91,8.88 v23.85,8.82 | 19.94,12.75 19.94,13.14 20.45,13.14 21.97,14.66 25.15,14.66
  other vias: 46.86,7.17 48.39,7.17 57.02,18.09
  pour Bottom: 70.74,24.82 70.74,0.18 0.25,0.18 0.25,24.82
  pour Top: 0.25,24.82 0.25,0.18 70.74,0.18 70.74,24.82
LED1  (via drill 0.35)
  Top 0.152: v1.65,21.77 1.91,21.52 7.49,21.52 8.76,20.25 8.76,7.22 DS1.A
  Top 0.305: DS1.A 8.21,5.69 8.26,5.64 LED1.A
  Bottom 0.152: v1.65,21.77 1.65,22.79 3.47,22.79 R11.1
W1-VCC  (via drill 0.35)
  Top 0.152: v13.75,12.45 13.75,13.64 13.74,13.65 13.74,14.56 13.84,14.66 14.86,14.66 15.37,14.15 v15.37,13.82
  Bottom 0.152: C1.1 19.43,15.68 18.67,14.91 16.56,14.91 16,14.36 15.9,14.36 v15.37,13.82 | v13.75,12.45 13.72,12.42 U1.8
  Bottom 0.305: C1.1 R1.1
W1-W2
  Bottom 0.152: U2.6 23.88,12.37 23.42,12.83 21,12.83 20.7,12.53 20.7,11.61 20.51,11.42 17.91,11.42 17.78,11.55 U1.5
W1B
  Bottom 0.152: U1.3 16.26,15.04 15.88,14.66 13.59,14.66 13.08,15.17 13.08,17.2 12.32,17.96 12.32,20.03 O1.B 11.32,22.52 U$9.43
W1G
  Bottom 0.152: U1.1 13.72,17.33 14.35,17.96 14.35,19.99 O1.G 13.32,22.52 U$9.33
W1R
  Bottom 0.152: U1.2 14.99,17.33 15.11,17.45 15.37,17.45 16.38,18.47 16.38,19.96 O1.R 15.32,22.49 U$9.23
W2-VCC
  Bottom 0.152: R2.1 17.38,9.04 18.24,8.18 19.08,8.18 19.45,7.82 20.89,7.82 C2.1 21.95,9.85 21.34,10.47 U2.8
W2-W3  (via drill 0.35)
  Top 0.152: v17.65,2.98 18.41,2.21 19.43,2.21 19.68,2.47 19.68,3.48 16.38,6.79 SKIP1.2 16.89,7.8 19.94,7.8 24.26,12.12 v24.26,13.9
  Bottom 0.152: U3.6 18.26,2.37 v17.65,2.98 | v24.26,13.9 25.15,13.01 U2.5
W2B
  Bottom 0.152: U2.3 23.88,15.55 23.49,15.17 20.95,15.17 20.7,15.42 20.7,18.81 20.83,18.94 20.83,20.12 21.99,21.28 O2.B 23.49,21.3 U$8.33
W2G
  Bottom 0.152: U2.1 21.34,19.61 21.97,20.25 24.48,20.25 O2.G 25.51,22.52 U$8.23
W2R
  Bottom 0.152: U2.2 22.61,17.84 22.99,18.22 26.29,18.22 26.54,18.47 26.54,20.31 O2.R 27.51,22.49 U$8.13
W3-VCC
  Bottom 0.152: R3.1 13.92,2.06 C3.1 15.5,2.08 15.72,1.86 U3.8
W3B
  Bottom 0.152: U3.3 18.26,4.91 18.67,4.5 19.94,4.5 22.68,7.24 25.83,7.24 26.54,6.53 26.54,4.72 O3.B 27.54,2.48 U$7.43
W3G  (via drill 0.35)
  Top 0.152: v15.62,3.23 17.14,1.71 19.94,1.71 20.19,1.96 20.19,3.74 v20.95,4.5
  Bottom 0.152: 24.51,4.75 O3.G 25.54,2.48 U$7.33 | 24.51,4.75 | v20.95,4.5 20.95,4.75 24.51,4.75 | v15.62,3.23 15.72,3.33 U3.1
W3R
  Bottom 0.152: U3.2 16.99,4.14 17.41,3.72 O3.R 23.49,3.67 U$7.23
W4-VCC  (via drill 0.35)
  Top 0.152: v32.54,12.45 32.54,13.64 32.54,13.65 32.54,14.56 32.64,14.66 33.66,14.66 34.16,14.15 v34.16,13.82
  Bottom 0.152: C4.1 38.23,15.68 37.47,14.91 35.36,14.91 34.8,14.36 34.7,14.36 v34.16,13.82 | v32.54,12.45 32.51,12.42 U4.8 | 38.23,19.99 38.48,20.25 38.48,20.66 R4.1
  Bottom 0.305: 38.23,19.99 38.23,15.68
W4-W5
  Bottom 0.152: U5.6 42.67,12.37 42.22,12.83 39.8,12.83 39.5,12.53 39.5,11.61 39.31,11.42 36.71,11.42 36.58,11.55 U4.5
W4B
  Bottom 0.152: U4.3 35.05,15.04 34.67,14.66 32.39,14.66 31.88,15.17 31.88,17.2 31.11,17.96 31.11,20.03 O4.B 30.11,22.52 U$14.43
W4G
  Bottom 0.152: U4.1 32.51,17.33 33.15,17.96 33.15,19.99 O4.G 32.12,22.52 U$14.33
W4R
  Bottom 0.152: U4.2 33.78,17.33 33.91,17.45 34.16,17.45 35.18,18.47 35.18,19.96 O4.R 34.12,22.49 U$14.23
W5-VCC
  Bottom 0.152: U5.8 40.13,10.47 40.75,9.85 C5.1 39.67,7.8 38.26,7.8 37.88,8.18 36.96,8.18 35.99,9.15 35.88,9.22 35.78,9.33 R5.1
W5-W6  (via drill 0.35)
  Top 0.152: v36.45,2.98 37.21,2.21 38.23,2.21 38.48,2.47 38.48,3.48 35.18,6.79 SKIP2.2 35.69,7.8 38.73,7.8 43.05,12.12 v43.05,13.9
  Bottom 0.152: U6.6 37.06,2.37 v36.45,2.98 | v43.05,13.9 43.94,13.01 U5.5
W5B
  Bottom 0.152: U5.3 42.67,15.55 42.29,15.17 39.75,15.17 39.5,15.42 39.5,18.81 39.62,18.94 39.62,20.12 40.78,21.28 O5.B 42.29,21.3 U$15.33
W5G
  Bottom 0.152: U5.1 40.13,19.61 40.77,20.25 43.28,20.25 O5.G 44.31,22.52 U$15.23
W5R
  Bottom 0.152: U5.2 41.4,17.84 41.78,18.22 45.09,18.22 45.34,18.47 45.34,20.31 O5.R 46.31,22.49 U$15.13
W6-VCC
  Bottom 0.152: R6.1 32.72,2.06 C6.1 34.29,2.08 34.52,1.86 U6.8
W6B
  Bottom 0.152: U6.3 37.06,4.91 37.47,4.5 38.73,4.5 41.48,7.24 44.63,7.24 45.34,6.53 45.34,4.72 O6.B 46.34,2.48 U$16.43
W6G  (via drill 0.35)
  Top 0.152: v34.42,3.23 35.94,1.71 38.73,1.71 38.99,1.96 38.99,3.74 v39.75,4.5
  Bottom 0.152: 43.31,4.75 O6.G 44.34,2.48 U$16.33 | 43.31,4.75 | v39.75,4.5 39.75,4.75 43.31,4.75 | v34.42,3.23 34.52,3.33 U6.1
W6R
  Bottom 0.152: U6.2 35.79,4.14 36.32,3.61 42.23,3.61 O6.R 42.34,2.52 U$16.23
W7-VCC
  Bottom 0.152: U7.8 57.08,13.26 58.04,14.22 58.04,18.72 57.02,19.74 C7.1 57.05,20.86 R7.1
W7-W8  (via drill 0.35)
  Top 0.152: v55.25,16.95 55.5,16.69 v63.12,16.69
  Bottom 0.152: U7.5 55.37,17.07 v55.25,16.95 | v63.12,16.69 63.12,14.66 62.99,14.53 U8.6
W7B
  Bottom 0.152: U7.3 53.34,15.8 53.72,16.18 53.72,17.45 53.47,17.71 50.16,17.71 49.91,17.96 49.91,20.28 O7.B 48.91,22.52 U$17.43
W7G  (via drill 0.35)
  Top 0.152: v53.21,13.39 51.94,14.66 v51.94,18.32
  Bottom 0.152: v51.94,18.32 51.94,20.25 O7.G 50.91,22.52 U$17.33 | U7.1 53.09,13.26 v53.21,13.39
W7R
  Bottom 0.152: U7.2 53.59,14.53 54.03,14.97 54.03,17.58 53.98,17.63 53.98,20.22 O7.R 52.91,22.49 U$17.23
W8-VCC
  Bottom 0.152: R8.1 61.6,17.27 61.76,17.11 | 61.76,17.11 U8.8 | C8.1 60.62,17.11 61.76,17.11
W8-W9  (via drill 0.35)
  Top 0.152: v63.12,13.26 60.83,11.1 55.75,11.1 v55.25,10.6
  Bottom 0.152: U8.5 62.99,13.26 v63.12,13.26 | U9.6 55.37,10.47 v55.25,10.6
W8B
  Bottom 0.152: U8.3 66.86,14.41 64.9,14.41 64.64,14.66 64.64,20.25 O8.B 65.68,22.52 U$18.33
W8G  (via drill 0.35)
  Top 0.152: v65.61,16.42 65.61,17.25 v66.67,18.32
  Bottom 0.152: v66.67,18.32 66.67,20.25 67.68,21.25 O8.G 67.68,22.52 U$18.23 | U8.1 66.27,17.07 v65.61,16.42
W8R
  Bottom 0.152: U8.2 65.28,15.8 64.97,16.11 64.97,17.28 65.41,17.71 68.45,17.71 68.71,17.96 68.71,20.31 O8.R 69.68,22.49 U$18.13
W9-VCC
  Bottom 0.152: R9.1 57.05,4.14 C9.1 | 57.02,7.74 U9.8
  Bottom 0.305: C9.1 57.02,7.74
W9-W10  (via drill 0.35)
  Top 0.152: v55.25,11.61 54.99,11.61 54.48,11.1 54.48,10.34 54.99,9.83 60.33,9.83 | 60.33,9.83 62.87,9.83 63.12,9.58 v63.12,9.33 | SKIP3.2 60.33,9.83
  Bottom 0.152: U9.5 55.37,11.74 v55.25,11.61 | v63.12,9.33 62.99,9.2 U10.6
W9B
  Bottom 0.152: U9.3 53.85,10.47 54.03,10.29 54.03,4.81 O9.B | O9.B | O9.B 52.96,3.71 U$19.31
W9G  (via drill 0.35)
  Top 0.152: v51.94,6.53 53.11,7.7 v53.11,8.56
  Bottom 0.152: v51.94,6.53 51.94,4.75 50.94,3.75 O9.G 50.94,2.48 U$19.21 | v53.11,8.56 52.48,7.93 U9.1
W9R
  Bottom 0.152: U9.2 53.34,9.2 53.72,8.82 53.72,7.8 53.21,7.29 50.67,7.29 49.91,6.53 49.91,4.69 O9.R 48.94,2.52 U$19.11
W10-VCC
  Bottom 0.152: R10.1 61.6,6.53 59.31,8.82 C10.1 59.31,10.09 60.96,11.74 U10.8
W10B
  Bottom 0.152: U10.3 64.77,9.2 64.44,8.87 64.44,7.42 64.73,7.13 64.74,7.14 68.35,7.14 68.71,6.79 68.71,4.72 O10.B 69.71,2.48 U$20.43
W10G  (via drill 0.35)
  Top 0.152: v65.66,11.61 66.93,11.61 67.18,11.36 67.18,7.04 v66.67,6.53
  Bottom 0.152: v66.67,6.53 66.67,4.75 O10.G 67.71,2.48 U$20.33 | U10.1 65.79,11.74 v65.66,11.61
W10R
  Bottom 0.152: U10.2 64.52,10.47 64.13,10.09 64.13,7.29 64.46,6.96 64.64,6.78 64.64,4.79 O10.R 65.71,2.52 U$20.23

### Text on the board
tValues: DO GND DI 5V+ | DO GND DI 5V+ | DO GND DI 5V+
tDocu: + | + | + | + | + | + | IN | IN | OUT | OUT | + | +